# Altium project vi_measurement.PrjPcb
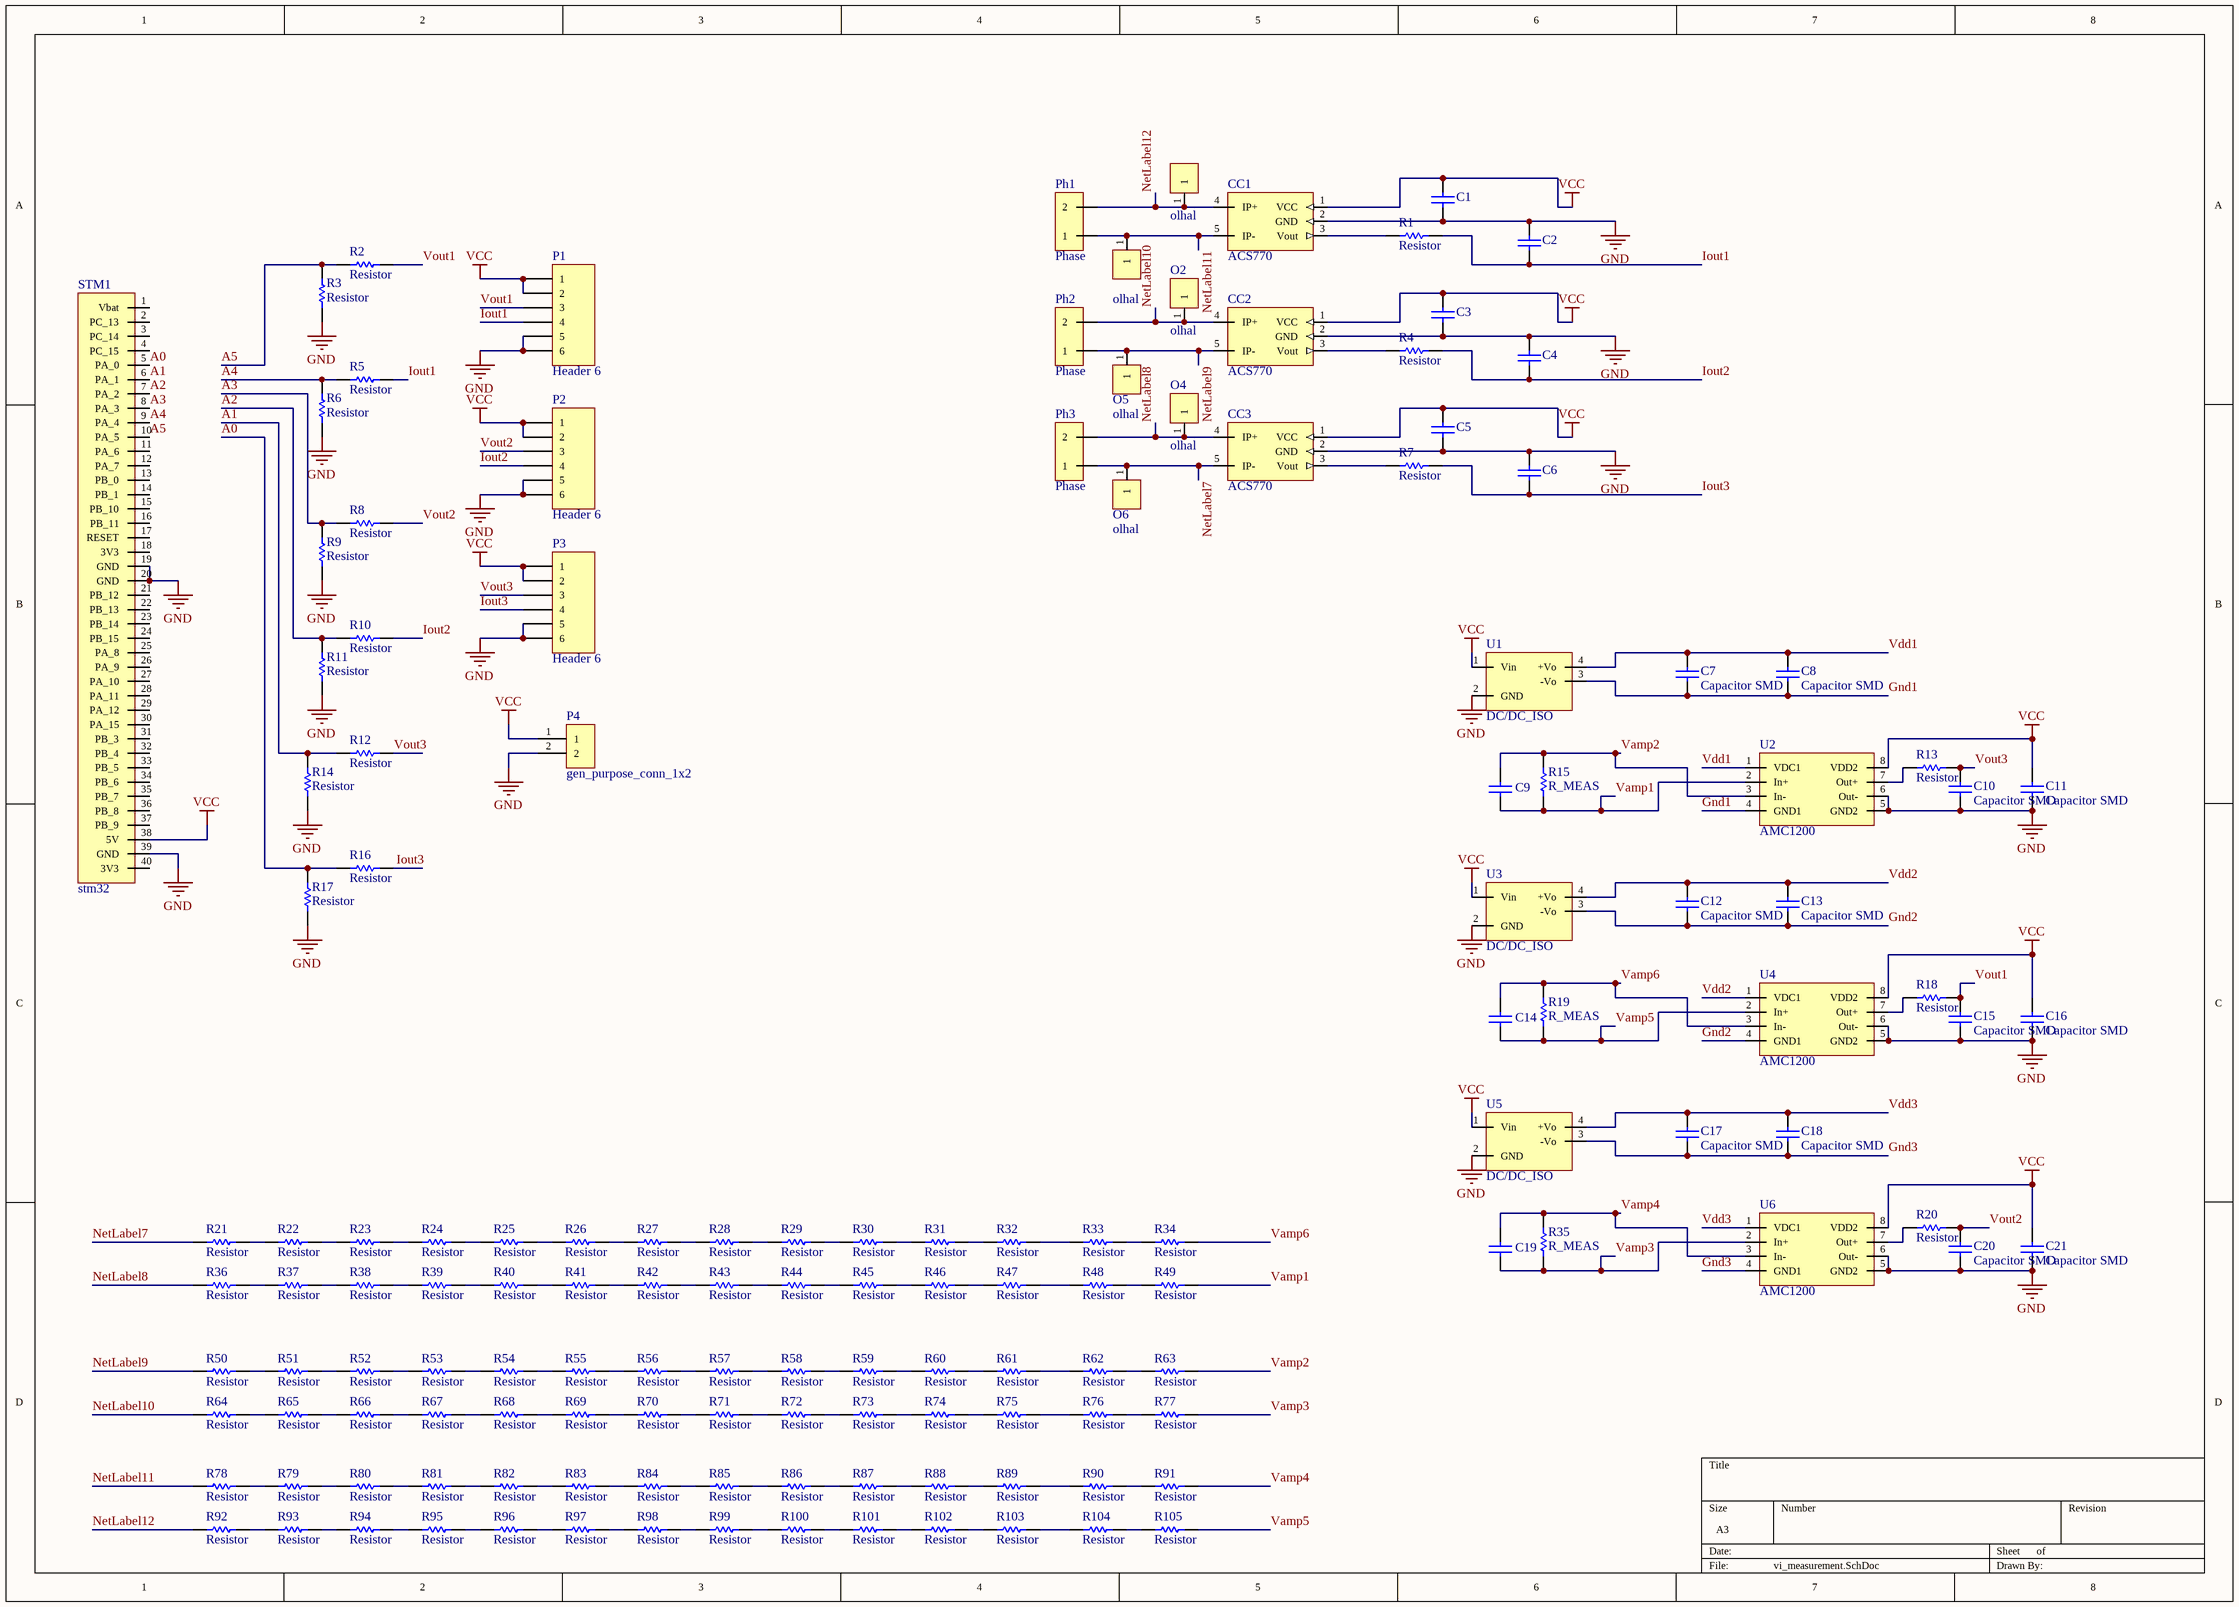
[diagram p0: vi_measurement.SchDoc]
1 sheet, 149 parts. Net scope: global (net labels, ports and power ports of the same name join across sheets).
Board file: vi_measurement.PcbDoc

## Sheet vi_measurement.SchDoc
size A3

### Parts
C1  (no value)  [CAPC_0805]
C2  (no value)  [CAPC_0805]
C3  (no value)  [CAPC_0805]
C4  (no value)  [CAPC_0805]
C5  (no value)  [CAPC_0805]
C6  (no value)  [CAPC_0805]
C7  Capacitor SMD  [CAPC_0805]
C8  Capacitor SMD  [CAPC_0805]
C9  Capacitor SMD  [CAPC_0805]  (value not drawn)
C10  Capacitor SMD  [CAPC_0805]
C11  Capacitor SMD  [CAPC_0805]
C12  Capacitor SMD  [CAPC_0805]
C13  Capacitor SMD  [CAPC_0805]
C14  Capacitor SMD  [CAPC_0805]  (value not drawn)
C15  Capacitor SMD  [CAPC_0805]
C16  Capacitor SMD  [CAPC_0805]
C17  Capacitor SMD  [CAPC_0805]
C18  Capacitor SMD  [CAPC_0805]
C19  Capacitor SMD  [CAPC_0805]  (value not drawn)
C20  Capacitor SMD  [CAPC_0805]
C21  Capacitor SMD  [CAPC_0805]
CC1  ACS770  [ACS770]
CC2  ACS770  [ACS770]
CC3  ACS770  [ACS770]
O1  olhal  [Olhal]
O2  olhal  [Olhal]
O3  olhal  [Olhal]
O4  olhal  [Olhal]
O5  olhal  [Olhal]
O6  olhal  [Olhal]
P1  Header 6  [HDR1X6]
P2  Header 6  [HDR1X6]
P3  Header 6  [HDR1X6]
P4  gen_purpose_conn_1x2  [connector1x2_parafuso]
Ph1  Phase  [Phoenix]
Ph2  Phase  [Phoenix]
Ph3  Phase  [Phoenix]
R1  Resistor  [RESC_0805]
R2  Resistor  [RESC_0805]
R3  Resistor  [RESC_0805]
R4  Resistor  [RESC_0805]
R5  Resistor  [RESC_0805]
R6  Resistor  [RESC_0805]
R7  Resistor  [RESC_0805]
R8  Resistor  [RESC_0805]
R9  Resistor  [RESC_0805]
R10  Resistor  [RESC_0805]
R11  Resistor  [RESC_0805]
R12  Resistor  [RESC_0805]
R13  Resistor  [RESC_0805]
R14  Resistor  [RESC_0805]
R15  R_MEAS  [RESC_0805]
R16  Resistor  [RESC_0805]
R17  Resistor  [RESC_0805]
R18  Resistor  [RESC_0805]
R19  R_MEAS  [RESC_0805]
R20  Resistor  [RESC_0805]
R21  Resistor  [RESC_0805]
R22  Resistor  [RESC_0805]
R23  Resistor  [RESC_0805]
R24  Resistor  [RESC_0805]
R25  Resistor  [RESC_0805]
R26  Resistor  [RESC_0805]
R27  Resistor  [RESC_0805]
R28  Resistor  [RESC_0805]
R29  Resistor  [RESC_0805]
R30  Resistor  [RESC_0805]
R31  Resistor  [RESC_0805]
R32  Resistor  [RESC_0805]
R33  Resistor  [RESC_0805]
R34  Resistor  [RESC_0805]
R35  R_MEAS  [RESC_0805]
R36  Resistor  [RESC_0805]
R37  Resistor  [RESC_0805]
R38  Resistor  [RESC_0805]
R39  Resistor  [RESC_0805]
R40  Resistor  [RESC_0805]
R41  Resistor  [RESC_0805]
R42  Resistor  [RESC_0805]
R43  Resistor  [RESC_0805]
R44  Resistor  [RESC_0805]
R45  Resistor  [RESC_0805]
R46  Resistor  [RESC_0805]
R47  Resistor  [RESC_0805]
R48  Resistor  [RESC_0805]
R49  Resistor  [RESC_0805]
R50  Resistor  [RESC_0805]
R51  Resistor  [RESC_0805]
R52  Resistor  [RESC_0805]
R53  Resistor  [RESC_0805]
R54  Resistor  [RESC_0805]
R55  Resistor  [RESC_0805]
R56  Resistor  [RESC_0805]
R57  Resistor  [RESC_0805]
R58  Resistor  [RESC_0805]
R59  Resistor  [RESC_0805]
R60  Resistor  [RESC_0805]
R61  Resistor  [RESC_0805]
R62  Resistor  [RESC_0805]
R63  Resistor  [RESC_0805]
R64  Resistor  [RESC_0805]
R65  Resistor  [RESC_0805]
R66  Resistor  [RESC_0805]
R67  Resistor  [RESC_0805]
R68  Resistor  [RESC_0805]
R69  Resistor  [RESC_0805]
R70  Resistor  [RESC_0805]
R71  Resistor  [RESC_0805]
R72  Resistor  [RESC_0805]
R73  Resistor  [RESC_0805]
R74  Resistor  [RESC_0805]
R75  Resistor  [RESC_0805]
R76  Resistor  [RESC_0805]
R77  Resistor  [RESC_0805]
R78  Resistor  [RESC_0805]
R79  Resistor  [RESC_0805]
R80  Resistor  [RESC_0805]
R81  Resistor  [RESC_0805]
R82  Resistor  [RESC_0805]
R83  Resistor  [RESC_0805]
R84  Resistor  [RESC_0805]
R85  Resistor  [RESC_0805]
R86  Resistor  [RESC_0805]
R87  Resistor  [RESC_0805]
R88  Resistor  [RESC_0805]
R89  Resistor  [RESC_0805]
R90  Resistor  [RESC_0805]
R91  Resistor  [RESC_0805]
R92  Resistor  [RESC_0805]
R93  Resistor  [RESC_0805]
R94  Resistor  [RESC_0805]
R95  Resistor  [RESC_0805]
R96  Resistor  [RESC_0805]
R97  Resistor  [RESC_0805]
R98  Resistor  [RESC_0805]
R99  Resistor  [RESC_0805]
R100  Resistor  [RESC_0805]
R101  Resistor  [RESC_0805]
R102  Resistor  [RESC_0805]
R103  Resistor  [RESC_0805]
R104  Resistor  [RESC_0805]
R105  Resistor  [RESC_0805]
STM1  stm32  [STM32]
U1  DC/DC_ISO  [DC/DC_ISO]
U2  AMC1200  [SOIC8]
U3  DC/DC_ISO  [DC/DC_ISO]
U4  AMC1200  [SOIC8]
U5  DC/DC_ISO  [DC/DC_ISO]
U6  AMC1200  [SOIC8]

### Nets
GND: C1.1 C2.2 C3.1 C4.2 C5.1 C6.2 C10.1 C11.1 C15.1 C16.1 C20.1 C21.1 CC1.2(GND) CC2.2(GND) CC3.2(GND) P1.5 P1.6 P2.5 P2.6 P3.5 P3.6 P4.2 R3.1 R6.1 R9.1 R11.1 R14.1 R17.1 STM1.19(GND) STM1.20(GND) STM1.39(GND) U1.2(GND) U2.5(GND2) U2.6(Out-) U3.2(GND) U4.5(GND2) U4.6(Out-) U5.2(GND) U6.5(GND2) U6.6(Out-)
VCC: C1.2 C3.2 C5.2 C11.2 C16.2 C21.2 CC1.1(VCC) CC2.1(VCC) CC3.1(VCC) P1.1 P1.2 P2.1 P2.2 P3.1 P3.2 P4.1 STM1.38(5V) U1.1(Vin) U2.8(VDD2) U3.1(Vin) U4.8(VDD2) U5.1(Vin) U6.8(VDD2)
A0: R16.1 R17.2 STM1.5(PA_0)
A1: R12.1 R14.2 STM1.6(PA_1)
A2: R10.1 R11.2 STM1.7(PA_2)
A3: R8.1 R9.2 STM1.8(PA_3)
A4: R5.1 R6.2 STM1.9(PA_4)
A5: R2.1 R3.2 STM1.10(PA_5)
Gnd1: C7.1 C8.1 U1.3(-Vo) U2.4(GND1)
Gnd2: C12.1 C13.1 U3.3(-Vo) U4.4(GND1)
Gnd3: C17.1 C18.1 U5.3(-Vo) U6.4(GND1)
Iout1: C2.1 P1.4 R1.2 R5.2
Iout2: C4.1 P2.4 R4.2 R10.2
Iout3: C6.1 P3.4 R7.2 R16.2
NetLabel7: CC3.5(IP-) O6.1 Ph3.1 R21.1
NetLabel8: CC3.4(IP+) O4.1 Ph3.2 R36.1
NetLabel9: CC2.5(IP-) O5.1 Ph2.1 R50.1
NetLabel10: CC2.4(IP+) O2.1 Ph2.2 R64.1
NetLabel11: CC1.5(IP-) O3.1 Ph1.1 R78.1
NetLabel12: CC1.4(IP+) O1.1 Ph1.2 R92.1
Vamp1: C9.1 R15.1 R49.2 U2.2(In+)
Vamp2: C9.2 R15.2 R63.2 U2.3(In-)
Vamp3: C19.1 R35.1 R77.2 U6.2(In+)
Vamp4: C19.2 R35.2 R91.2 U6.3(In-)
Vamp5: C14.1 R19.1 R105.2 U4.2(In+)
Vamp6: C14.2 R19.2 R34.2 U4.3(In-)
Vdd1: C7.2 C8.2 U1.4(+Vo) U2.1(VDC1)
Vdd2: C12.2 C13.2 U3.4(+Vo) U4.1(VDC1)
Vdd3: C17.2 C18.2 U5.4(+Vo) U6.1(VDC1)
Vout1: C15.2 P1.3 R2.2 R18.2
Vout2: C20.2 P2.3 R8.2 R20.2
Vout3: C10.2 P3.3 R12.2 R13.2
NetCC1_3: CC1.3(Vout) R1.1
NetCC2_3: CC2.3(Vout) R4.1
NetCC3_3: CC3.3(Vout) R7.1
NetR13_1: R13.1 U2.7(Out+)
NetR18_1: R18.1 U4.7(Out+)
NetR20_1: R20.1 U6.7(Out+)
NetR21_2: R21.2 R22.1
NetR22_2: R22.2 R23.1
NetR23_2: R23.2 R24.1
NetR24_2: R24.2 R25.1
NetR25_2: R25.2 R26.1
NetR26_2: R26.2 R27.1
NetR27_2: R27.2 R28.1
NetR28_2: R28.2 R29.1
NetR29_2: R29.2 R30.1
NetR30_2: R30.2 R31.1
NetR31_2: R31.2 R32.1
NetR32_2: R32.2 R33.1
NetR33_2: R33.2 R34.1
NetR36_2: R36.2 R37.1
NetR37_2: R37.2 R38.1
NetR38_2: R38.2 R39.1
NetR39_2: R39.2 R40.1
NetR40_2: R40.2 R41.1
NetR41_2: R41.2 R42.1
NetR42_2: R42.2 R43.1
NetR43_2: R43.2 R44.1
NetR44_2: R44.2 R45.1
NetR45_2: R45.2 R46.1
NetR46_2: R46.2 R47.1
NetR47_2: R47.2 R48.1
NetR48_2: R48.2 R49.1
NetR50_2: R50.2 R51.1
NetR51_2: R51.2 R52.1
NetR52_2: R52.2 R53.1
NetR53_2: R53.2 R54.1
NetR54_2: R54.2 R55.1
NetR55_2: R55.2 R56.1
NetR56_2: R56.2 R57.1
NetR57_2: R57.2 R58.1
NetR58_2: R58.2 R59.1
NetR59_2: R59.2 R60.1
NetR60_2: R60.2 R61.1
NetR61_2: R61.2 R62.1
NetR62_2: R62.2 R63.1
NetR64_2: R64.2 R65.1
NetR65_2: R65.2 R66.1
NetR66_2: R66.2 R67.1
NetR67_2: R67.2 R68.1
NetR68_2: R68.2 R69.1
NetR69_2: R69.2 R70.1
NetR70_2: R70.2 R71.1
NetR71_2: R71.2 R72.1
NetR72_2: R72.2 R73.1
NetR73_2: R73.2 R74.1
NetR74_2: R74.2 R75.1
NetR75_2: R75.2 R76.1
NetR76_2: R76.2 R77.1
NetR78_2: R78.2 R79.1
NetR79_2: R79.2 R80.1
NetR80_2: R80.2 R81.1
NetR81_2: R81.2 R82.1
NetR82_2: R82.2 R83.1
NetR83_2: R83.2 R84.1
NetR84_2: R84.2 R85.1
NetR85_2: R85.2 R86.1
NetR86_2: R86.2 R87.1
NetR87_2: R87.2 R88.1
NetR88_2: R88.2 R89.1
NetR89_2: R89.2 R90.1
NetR90_2: R90.2 R91.1
NetR92_2: R92.2 R93.1
NetR93_2: R93.2 R94.1
NetR94_2: R94.2 R95.1
NetR95_2: R95.2 R96.1
NetR96_2: R96.2 R97.1
NetR97_2: R97.2 R98.1
NetR98_2: R98.2 R99.1
NetR99_2: R99.2 R100.1
NetR100_2: R100.2 R101.1
NetR101_2: R101.2 R102.1
NetR102_2: R102.2 R103.1
NetR103_2: R103.2 R104.1
NetR104_2: R104.2 R105.1

Not connected (* = marked no-connect by the designer): STM1 1(Vbat) 2(PC_13) 3(PC_14) 4(PC_15) 11(PA_6) 12(PA_7) 13(PB_0) 14(PB_1) 15(PB_10) 16(PB_11) 17(RESET) 18(3V3) 21(PB_12) 22(PB_13) 23(PB_14) 24(PB_15) 25(PA_8) 26(PA_9) 27(PA_10) 28(PA_11) 29(PA_12) 30(PA_15) 31(PB_3) 32(PB_4) 33(PB_5) 34(PB_6) 35(PB_7) 36(PB_8) 37(PB_9) 40(3V3)

### Library data of the parts
C1 C3 C5 C7 C8 C11-C13 C16-C18 C21 = Capacitor SMD: 10uF; LCSC: C337995
C2 C4 C6 C9 C10 C14 C15 C19 C20 = Capacitor SMD: 1uF; LCSC: C282734
P1-P3 = Header 6: Header, 6-Pin; LatestRevisionDate: 17-Jul-2002; LatestRevisionNote: Re-released for DXP Platform.; Publisher: Altium Limited
Ph1-Ph3 = Phoenix
R1 R4 R7 R13 R18 R20 = Resistor: 330R; LCSC: C269732
R2 R5 R8 R10 R12 R16 = Resistor: 5K; LCSC: C105427
R3 R6 R9 R11 R14 R17 R21 R36-R105 = Resistor: 7K5; LCSC: C294739
R15 R19 R35 = Resistor: 200R
U1 U3 U5 = DC/DC_ISO: LCSC: C98815
U2 U4 U6 = AMC1200: LCSC: C79905